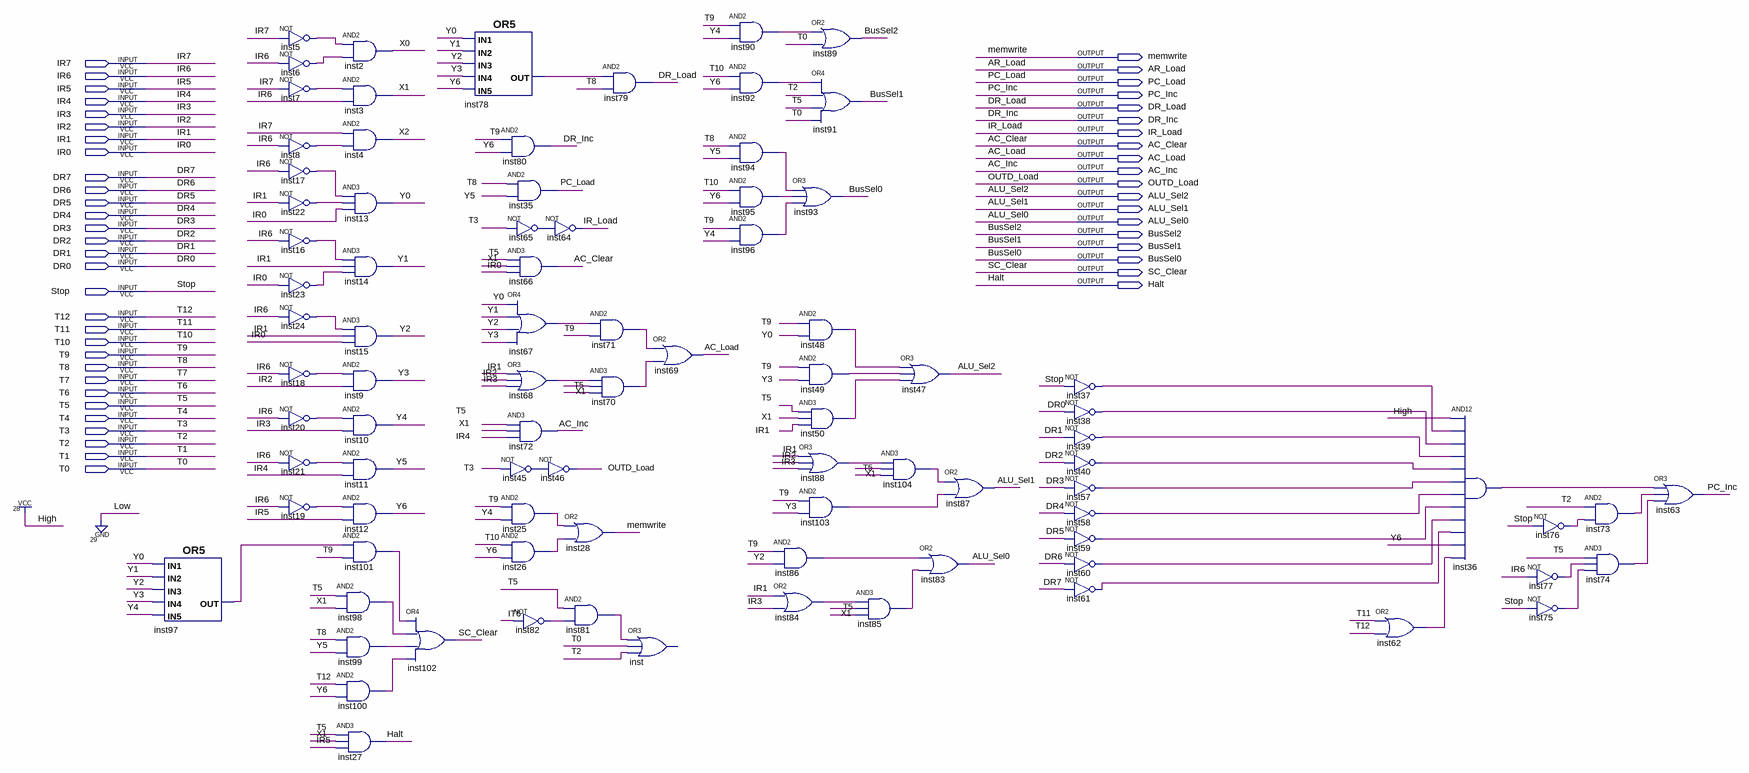
[diagram p0: schematic sheet]
// Quartus schematic lab3controller - COPy.bdf as structural Verilog: 88 symbols, 49 pins
module \lab3controller_-_COPy  (
  input  IR7,
  input  IR6,
  input  IR5,
  input  IR4,
  input  IR3,
  input  IR2,
  input  IR1,
  input  IR0,
  input  DR7,
  input  DR6,
  input  DR5,
  input  DR4,
  input  DR3,
  input  DR2,
  input  DR1,
  input  DR0,
  input  Stop,
  input  T12,
  input  T11,
  input  T10,
  input  T9,
  input  T8,
  input  T7,
  input  T6,
  input  T5,
  input  T4,
  input  T3,
  input  T2,
  input  T1,
  input  T0,
  output memwrite,
  output AR_Load,
  output PC_Load,
  output PC_Inc,
  output DR_Load,
  output DR_Inc,
  output IR_Load,
  output AC_Clear,
  output AC_Load,
  output AC_Inc,
  output OUTD_Load,
  output ALU_Sel2,
  output ALU_Sel1,
  output ALU_Sel0,
  output BusSel2,
  output BusSel1,
  output BusSel0,
  output SC_Clear,
  output Halt
);

  wire inst5_out, inst6_out, inst7_out, inst8_out, inst16_out, inst17_out, inst18_out, inst19_out,
       inst20_out, inst21_out, inst22_out, inst23_out, inst24_out, inst25_out, inst26_out, inst36_out,
       inst37_out, inst38_out, inst39_out, inst40_out, inst45_out, inst48_out, inst49_out, inst50_out,
       inst57_out, inst58_out, inst59_out, inst60_out, inst61_out, inst62_out, inst65_out, inst67_out,
       inst68_out, inst70_out, inst71_out, inst73_out, inst74_out, inst75_out, inst76_out, inst77_out,
       inst78_out, inst81_out, inst82_out, inst84_out, inst85_out, inst86_out, inst88_out, inst90_out,
       inst92_out, inst94_out, inst95_out, inst96_out, inst97_out, inst98_out, inst99_out, inst100_out,
       inst101_out, inst103_out, inst104_out, IT6, X0, X1, X2, Y0, Y1, Y2, Y3, Y4, Y5, Y6;

  or inst97 (inst97_out, Y0, Y1, Y2, Y3, Y4);
  not inst5 (inst5_out, IR7);
  not inst6 (inst6_out, IR6);
  not inst7 (inst7_out, IR7);
  not inst8 (inst8_out, IR6);
  not inst17 (inst17_out, IR6);
  not inst22 (inst22_out, IR1);
  not inst16 (inst16_out, IR6);
  not inst23 (inst23_out, IR0);
  not inst24 (inst24_out, IR6);
  not inst18 (inst18_out, IR6);
  not inst20 (inst20_out, IR6);
  not inst21 (inst21_out, IR6);
  not inst19 (inst19_out, IR6);
  and inst98 (inst98_out, T5, X1);
  and inst99 (inst99_out, T8, Y5);
  and inst100 (inst100_out, T12, Y6);
  and inst27 (Halt, T5, X1, IR5);
  and inst2 (X0, inst5_out, inst6_out);
  and inst3 (X1, inst7_out, IR6);
  and inst4 (X2, IR7, inst8_out);
  and inst13 (Y0, inst17_out, inst22_out, IR0);
  and inst14 (Y1, inst16_out, IR1, inst23_out);
  and inst15 (Y2, inst24_out, IR1, IR0);
  and inst9 (Y3, inst18_out, IR2);
  and inst10 (Y4, inst20_out, IR3);
  and inst11 (Y5, inst21_out, IR4);
  and inst12 (Y6, inst19_out, IR5);
  and inst101 (inst101_out, inst97_out, T9);
  or inst102 (SC_Clear, inst101_out, inst98_out, inst99_out, inst100_out);
  or inst78 (inst78_out, Y0, Y1, Y2, Y3, Y6);
  and inst80 (DR_Inc, T9, Y6);
  and inst35 (PC_Load, T8, Y5);
  not inst65 (inst65_out, T3);
  and inst66 (AC_Clear, T5, X1, IR0);
  or inst67 (inst67_out, Y0, Y1, Y2, Y3);
  or inst68 (inst68_out, IR1, IR2, IR3);
  and inst72 (AC_Inc, T5, X1, IR4);
  not inst45 (inst45_out, T3);
  not inst46 (OUTD_Load, inst45_out);
  and inst25 (inst25_out, T9, Y4);
  and inst26 (inst26_out, T10, Y6);
  not inst82 (inst82_out, IT6);
  not inst64 (IR_Load, inst65_out);
  and inst71 (inst71_out, inst67_out, T9);
  and inst70 (inst70_out, inst68_out, T5, X1);
  or inst28 (memwrite, inst25_out, inst26_out);
  and inst81 (inst81_out, T5, inst82_out);
  and inst79 (DR_Load, inst78_out, T8);
  // OR3 inst has open pins: IN1=inst81_out, IN2=T0, IN3=T2, OUT=open
  or inst69 (AC_Load, inst71_out, inst70_out);
  and inst90 (inst90_out, T9, Y4);
  and inst92 (inst92_out, T10, Y6);
  and inst94 (inst94_out, T8, Y5);
  and inst95 (inst95_out, T10, Y6);
  and inst96 (inst96_out, T9, Y4);
  or inst93 (BusSel0, inst94_out, inst95_out, inst96_out);
  and inst86 (inst86_out, T9, Y2);
  or inst84 (inst84_out, IR1, IR3);
  or inst89 (BusSel2, inst90_out, T0);
  or inst91 (BusSel1, inst92_out, T2, T5, T0);
  and inst48 (inst48_out, T9, Y0);
  and inst49 (inst49_out, T9, Y3);
  and inst50 (inst50_out, T5, X1, IR1);
  or inst88 (inst88_out, IR1, IR2, IR3);
  and inst103 (inst103_out, T9, Y3);
  and inst104 (inst104_out, inst88_out, T5, X1);
  and inst85 (inst85_out, inst84_out, T5, X1);
  or inst47 (ALU_Sel2, inst48_out, inst49_out, inst50_out);
  or inst87 (ALU_Sel1, inst104_out, inst103_out);
  or inst83 (ALU_Sel0, inst86_out, inst85_out);
  not inst37 (inst37_out, Stop);
  not inst38 (inst38_out, DR0);
  not inst39 (inst39_out, DR1);
  not inst40 (inst40_out, DR2);
  not inst57 (inst57_out, DR3);
  not inst58 (inst58_out, DR4);
  not inst59 (inst59_out, DR5);
  not inst60 (inst60_out, DR6);
  not inst61 (inst61_out, DR7);
  or inst62 (inst62_out, T11, T12);
  and inst36 (inst36_out, 1'b1, inst37_out, inst38_out, inst39_out, inst40_out, inst57_out, inst58_out, inst59_out, inst60_out, inst61_out, Y6, inst62_out);
  not inst76 (inst76_out, Stop);
  not inst77 (inst77_out, IR6);
  not inst75 (inst75_out, Stop);
  and inst73 (inst73_out, T2, inst76_out);
  and inst74 (inst74_out, T5, inst77_out, inst75_out);
  or inst63 (PC_Inc, inst36_out, inst73_out, inst74_out);
endmodule
